# EAGLE schematic main (EAGLE 6.5.0)
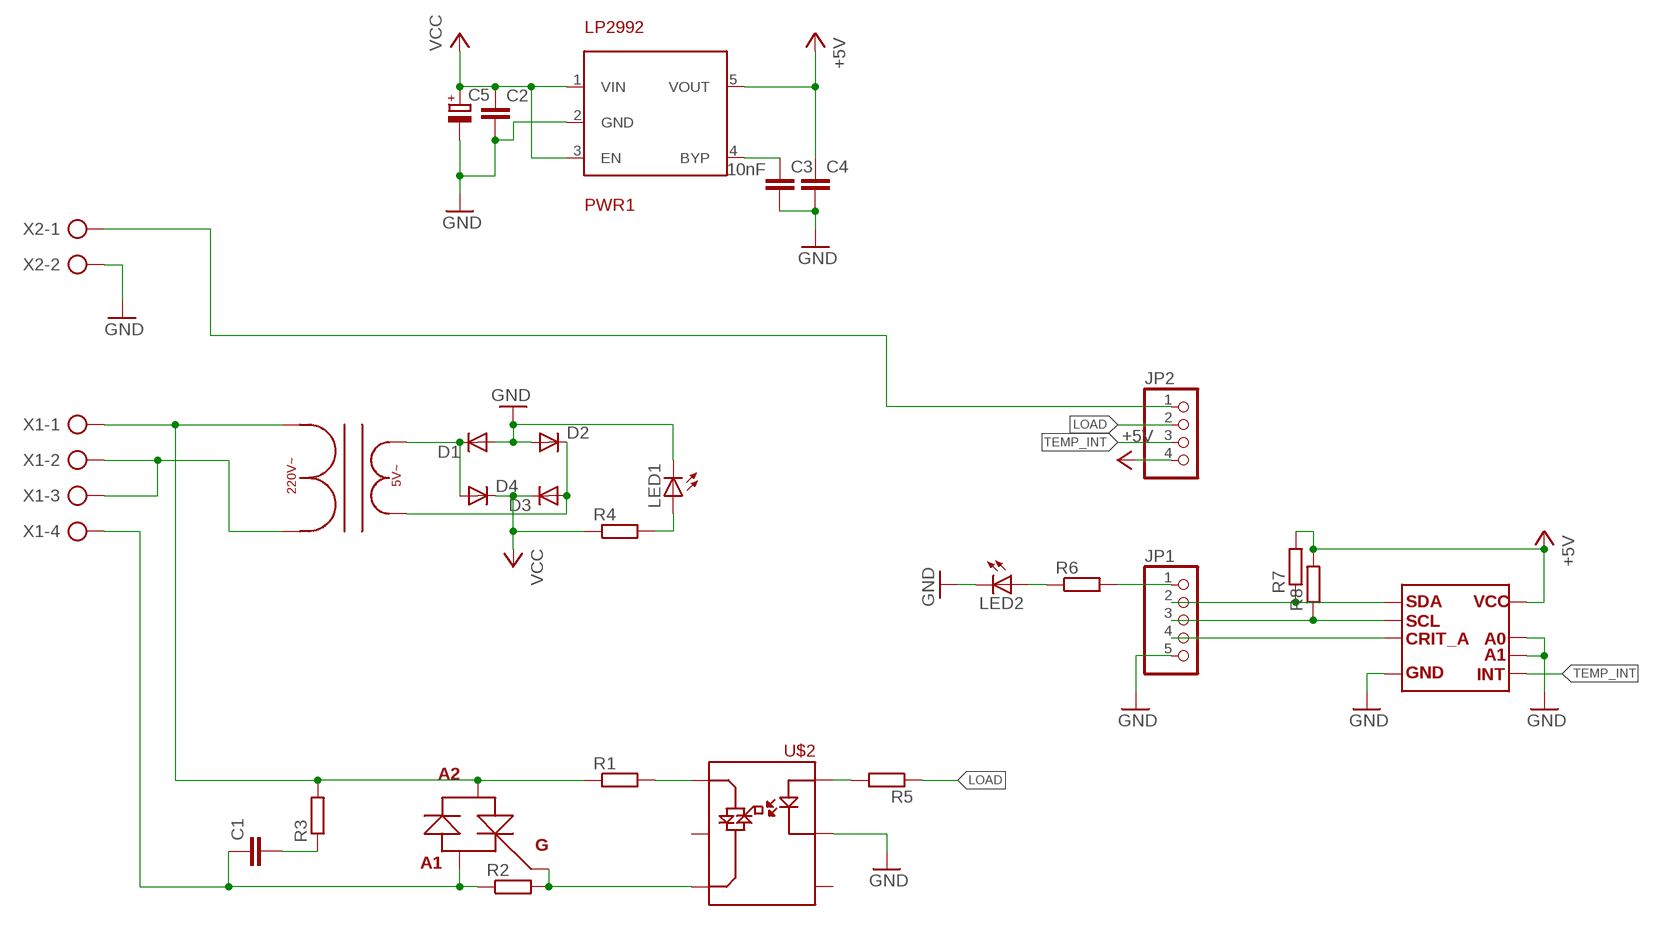
[diagram p0: schematic, sheet 1]

## Parts
C1  C-EU075-052X106  [C075-052X106]
C2  C-EUC0805  [C0805]
C3  C-EUC0805  [C0805]
C4  C-EUC0805  [C0805]
C5  CPOL-EUSMCA  [SMC_A]
D1  DIODE-DO-214AC  [DO-214AC]
D2  DIODE-DO-214AC  [DO-214AC]
D3  DIODE-DO-214AC  [DO-214AC]
D4  DIODE-DO-214AC  [DO-214AC]
JP1  PINHD-1X5  [1X05]
JP2  PINHD-1X4  [1X04]
LED1  LED3MM  [LED3MM]
LED2  LED3MM  [LED3MM]
PWR1  LP2992  [SOT23-5]
R1  R-EU_M1206  [M1206]
R2  R-EU_M1206  [M1206]
R3  R-EU_M1206  [M1206]
R4  R-EU_M0805  [M0805]
R5  R-EU_M0805  [M0805]
R6  R-EU_M0805  [M0805]
R7  R-EU_M0805  [M0805]
R8  R-EU_M0805  [M0805]
TMP1  LM92  [SOIC8-1.27-5X4MM]
U$1  ТПГ-0.7-5V  [TPG-0.7-5V]
U$2  MOC3043  [DIL06]
U$3  BTB16  [TO220NORM]
X1  AK500/4  [AK500/4]
X2  AK500/2  [AK500/2]

## Nets
+5V: C4.1 JP2.4 PWR1.5(VOUT) R7.2 R8.2 TMP1.8(OUT)
GND: C2.2 C3.2 C4.2 C5.- D1.A D2.A JP1.5 LED1.K(C) LED2.K(C) PWR1.2(GND) TMP1.4(OUT) TMP1.6(OUT) TMP1.7(OUT) U$2.2(LED_OUT) X2.2
LOAD: JP2.2 R5.1
N$1: U$1.AC1 X1.2 X1.3
N$2: R1.1 R3.2 U$1.AC2 U$3.MT2(A2) X1.1
N$3: D1.C D4.A U$1.DC2
N$4: D2.C D3.A U$1.DC1
N$8: R1.2 U$2.6(SIM1)
N$9: R2.2 U$2.4(SIM2) U$3.GATE(G)
N$10: C1.1 R2.1 U$3.MT1(A1) X1.4
N$11: C1.2 R3.1
N$13: LED1.A R4.2
N$14: R5.2 U$2.1(LED_IN)
N$16: C3.1 PWR1.4(BYP)
N$17: JP1.1 R6.2
N$18: LED2.A R6.1
N$19: JP1.2 R7.1 TMP1.1(OUT)
N$20: JP1.3 R8.1 TMP1.2(OUT)
N$21: JP1.4 TMP1.3(OUT)
N$23: JP2.1 X2.1
TEMP_INT: JP2.3 TMP1.5(OUT)
VCC: C2.1 C5.+ D3.C D4.C PWR1.1(VIN) PWR1.3(EN) R4.1
Unconnected: U$2.3(N/C) U$2.5(N/C2)

## Library data of the parts
C1-C4 = rcl:C-EU: CAPACITOR, European symbol
C5 = rcl:CPOL-EU: POLARIZED CAPACITOR, European symbol
D1-D4 = diode:DIODE-: DIODE
JP1 = pinhead:PINHD-1X5: PIN HEADER
JP2 = pinhead:PINHD-1X4: PIN HEADER
LED1 LED2 = led:LED: LED OSRAM: - CHIPLED LG R971, LG N971, LY N971, LG Q971, LY Q971, LO R971, LY R971 LH N974, LH R974 LS Q976, LO Q976, LY Q976 LO Q996 - Hyper CHIPLED LW Q18S LB Q993, LB Q99A, LB R99A - SideLED LS A670, LO A670, LY A670, LG A670, LP A670 LB A673, LV A673, LT A673, LW A673 LH A674 LY A675 LS A676, LA A676, LO A676, LY A676, LW A676 LS A679, LY A679, LG A679 - Hyper Micro SIDELED® LS Y876, LA Y876, LO Y876, LY Y876 LT Y87S - SmartLED LW L88C, LW L88S LB L89C, LB L89S, LG L890 LS L89K, LO L89K, LY L89K LS L896, LA L896, LO L896, LY L896 - TOPLED LS T670, LO T670, LY T670, LG T670, LP T670 LSG T670, LSP T670, LSY T670, LOP T670, LYG T670 LG T671, LOG T671, LSG T671 LB T673, LV T673, LT T673, LW T673 LH T674 LS T676, LA T676, LO T676, LY T676, LB T676, LH T676, LSB T676, LW T676 LB T67C, LV T67C, LT T67C, LS T67K, LO T67K, LY T67K, LW E67C LS E67B, LA E67B, LO E67B, LY E67B, LB E67C, LV E67C, LT E67C LW T67C LS T679, LY T679, LG T679 LS T770, LO T770, LY T770, LG T770, LP T770 LB T773, LV T773, LT T773, LW T773 LH T774 LS E675, LA E675, LY E675, LS T675 LS T776, LA T776, LO T776, LY T776, LB T776 LHGB T686 LT T68C, LB T68C - Hyper Mini TOPLED® LB M676 - Mini TOPLED Santana® LG M470 LS M47K, LO M47K, LY M47K Source: http://www.osram.convergy.de LUXEON: - LUMILED® LXK2-PW12-R00, LXK2-PW12-S00, LXK2-PW14-U00, LXK2-PW14-V00 LXK2-PM12-R00, LXK2-PM12-S00, LXK2-PM14-U00 LXK2-PE12-Q00, LXK2-PE12-R00, LXK2-PE12-S00, LXK2-PE14-T00, LXK2-PE14-U00 LXK2-PB12-K00, LXK2-PB12-L00, LXK2-PB12-M00, LXK2-PB14-N00, LXK2-PB14-P00, LXK2-PB14-Q00 LXK2-PR12-L00, LXK2-PR12-M00, LXK2-PR14-Q00, LXK2-PR14-R00 LXK2-PD12-Q00, LXK2-PD12-R00, LXK2-PD12-S00 LXK2-PH12-R00, LXK2-PH12-S00 LXK2-PL12-P00, LXK2-PL12-Q00, LXK2-PL12-R00 Source: www.luxeon.com KINGBRIGHT: KA-3528ASYC Source: www.kingbright.com
PWR1 = My_TI:LP2992
R1-R8 = rcl:R-EU_: RESISTOR, European symbol
TMP1 = My_TI:LM92: ±0.33°C Accurate, 12-Bit + Sign Temperature Sensor and Thermal Window Comparator With Two-Wire Interface
U$1 = Trasformators:ТПГ-0.7-5V
U$2 = OpticalSwitch:MOC3043
U$3 = Semistors:BTB16: Silicon Bidirectional Thyristors. Blocking Voltage to 800 V. On-State Current Rating of 16 A RMS at 25°C. http://www.onsemi.ru.com/pub_link/Collateral/BTB16-600CW3-D.PDF
X1 = con-ptr500:AK500/4: CONNECTOR; OC_FARNELL: unknown; OC_NEWARK: unknown
X2 = con-ptr500:AK500/2: CONNECTOR; OC_FARNELL: unknown; OC_NEWARK: unknown